# Altium project seed_sentinel.PrjPcb
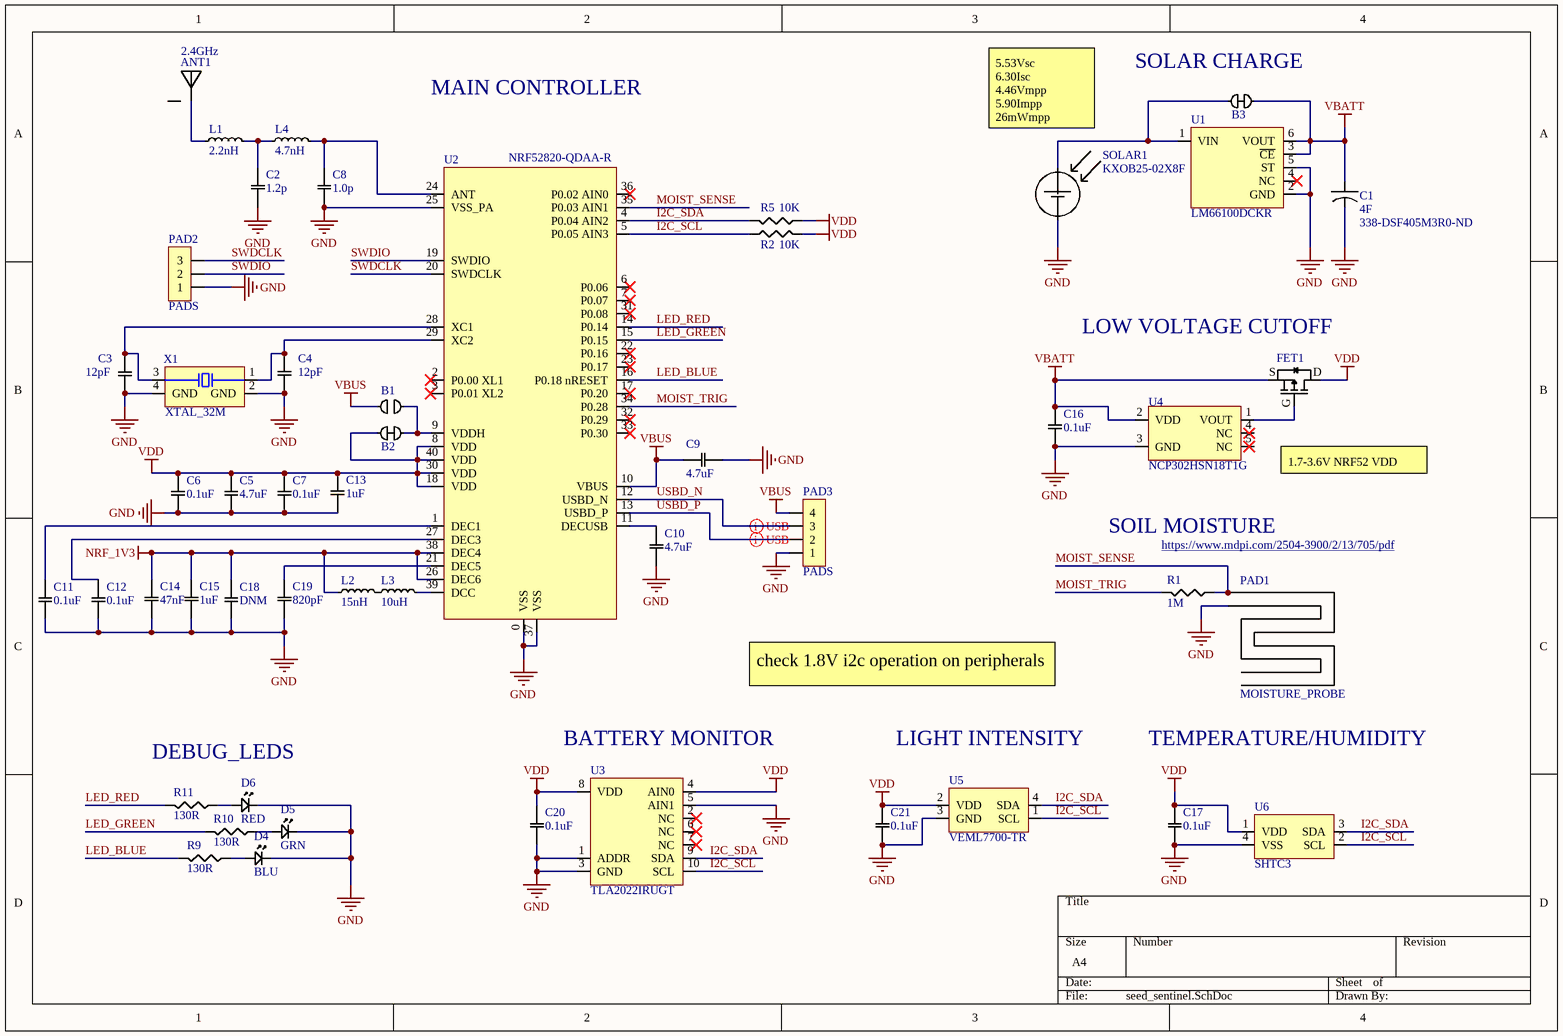
[diagram p0: seed_sentinel.SchDoc]
1 sheet, 50 parts. Net scope: global (net labels, ports and power ports of the same name join across sheets).
Board file: seed_sentinel.PcbDoc

## Sheet seed_sentinel.SchDoc
size A4

### Parts
ANT1  2.4GHz  [ANT_RFANT5220110A2T]
B1  SOLDER_BRIDGE_NO  [SOLDER_BRIDGE_NO]  (value not drawn)
B2  SOLDER_BRIDGE_C  [SOLDER_BRIDGE_NC]  (value not drawn)  (net tie, no BOM)
B3  SOLDER_BRIDGE_C  [SOLDER_BRIDGE_NC]  (value not drawn)  (net tie, no BOM)
C1  4F  Supplier Part Number 1: 338-DSF405M3R0-ND  [CAP_8mm]
C2  1.2p  [CHIP_0402]
C3  12pF  [CHIP_0402]
C4  12pF  [CHIP_0402]
C5  4.7uF  [CHIP_0402]
C6  0.1uF  [CHIP_0402]
C7  0.1uF  [CHIP_0402]
C8  1.0p  [CHIP_0402]
C9  4.7uF  [CHIP_0402]
C10  4.7uF  [CHIP_0402]
C11  0.1uF  [CHIP_0402]
C12  0.1uF  [CHIP_0402]
C13  1uF  [CHIP_0402]
C14  47nF  [CHIP_0402]
C15  1uF  [CHIP_0402]
C16  0.1uF  [CHIP_0402]
C17  0.1uF  [CHIP_0402]
C18  DNM  [CHIP_0402]
C19  820pF  [CHIP_0402]
C20  0.1uF  [CHIP_0402]
C21  0.1uF  [CHIP_0402]
D4  BLU  [LED_0402]
D5  GRN  [LED_0402]
D6  RED  [LED_0402]
FET1  RV2C014BCT2CL  [DFN1006-3]  (value not drawn)
L1  2.2nH  [CHIP_0402]
L2  15nH  [CHIP_0402]
L3  10uH  [CHIP_0603]
L4  4.7nH  [CHIP_0402]
PAD1  MOISTURE_PROBE  [MOIST_CAP]
PAD2  PADS  [CON_PADS_3]
PAD3  PADS  [CON_PADS_4]
R1  1M  [CHIP_0402]
R2  10K  [CHIP_0402]
R5  10K  [CHIP_0402]
R9  130R  [CHIP_0402]
R10  130R  [CHIP_0402]
R11  130R  [CHIP_0402]
SOLAR1  KXOB25-02X8F  [SOLAR]
U1  LM66100DCKR  [SC70-6]
U2  NRF52820-QDAA-R  [QFN40 5x5]
U3  TLA2022IRUGT  [RQFP_10]
U4  NCP302HSN18T1G  [TSOP-5]
U5  VEML7700-TR  [VEML7700]
U6  SHTC3  [SHTC3]
X1  XTAL_32M  [ECS-320]

### Nets
GND: C1.- C2.1 C3.2 C4.1 C5.2 C6.2 C7.2 C8.1 C9.2 C10.2 C11.2 C12.2 C13.1 C14.1 C15.1 C16.2 C17.2 C18.2 C19.1 C20.2 C21.2 D4.C D5.C D6.C PAD1.2 PAD2.1 PAD3.1 SOLAR1.- U1.2(GND) U1.5(ST) U2.0(VSS) U2.25(VSS_PA) U2.37(VSS) U3.1(ADDR) U3.3(GND) U3.5(AIN1) U4.3(GND) U5.3(GND) U6.4(VSS) X1.2(GND) X1.4(GND)
NRF_1V3: C14.2 C15.2 C18.1 L2.1 U2.26(DEC6) U2.38(DEC4)
VBATT: B3.2 C1.+ C16.1 FET1.S U1.3(~{CE}) U1.6(VOUT) U4.2(VDD)
VBUS: B1.2 C9.1 PAD3.4 U2.10(VBUS)
VDD: B2.1 C5.1 C6.1 C7.1 C13.2 C17.1 C20.1 C21.1 FET1.D R2.2 R5.1 U2.8(VDD) U2.18(VDD) U2.30(VDD) U2.40(VDD) U3.4(AIN0) U3.8(VDD) U5.2(VDD) U6.1(VDD)
I2C_SCL: R2.1 U2.5(P0.05_AIN3) U3.10(SCL) U5.1(SCL) U6.2(SCL)
I2C_SDA: R5.2 U2.4(P0.04_AIN2) U3.9(SDA) U5.4(SDA) U6.3(SDA)
LED_BLUE: R9.2 U2.16(P0.18_nRESET)
LED_GREEN: R10.2 U2.15(P0.15)
LED_RED: R11.2 U2.14(P0.14)
MOIST_SENSE: PAD1.1 R1.1 U2.35(P0.03_AIN1)
MOIST_TRIG: R1.2 U2.34(P0.28)
SWDCLK: PAD2.3 U2.20(SWDCLK)
SWDIO: PAD2.2 U2.19(SWDIO)
USBD_N: PAD3.3 U2.12(USBD_N)
USBD_P: PAD3.2 U2.13(USBD_P)
NetANT1_IN: ANT1.IN L1.1
NetB1_1: B1.1 B2.2 U2.9(VDDH)
NetB3_1: B3.1 SOLAR1.+ U1.1(VIN)
NetC2_2: C2.2 L1.2 L4.1
NetC3_1: C3.1 U2.28(XC1) X1.3
NetC4_2: C4.2 U2.29(XC2) X1.1
NetC8_2: C8.2 L4.2 U2.24(ANT)
NetC10_1: C10.1 U2.11(DECUSB)
NetC11_1: C11.1 U2.1(DEC1)
NetC12_1: C12.1 U2.27(DEC3)
NetC19_2: C19.2 U2.21(DEC5)
NetD4_A: D4.A R9.1
NetD5_A: D5.A R10.1
NetD6_A: D6.A R11.1
NetFET1_G: FET1.G U4.1(VOUT)
NetL2_2: L2.2 L3.1
NetL3_2: L3.2 U2.39(DCC)

Not connected (* = marked no-connect by the designer): ANT1 NC; U1 4(NC)*; U2 2(P0.00_XL1)* 3(P0.01_XL2)* 6(P0.06)* 7(P0.07)* 17(P0.20)* 22(P0.16)* 23(P0.17)* 31(P0.08)* 32(P0.29)* 33(P0.30)* 36(P0.02_AIN0)*; U3 2(NC)* 6(NC)* 7(NC)*; U4 4(NC) 5(NC)

### Layout directives
differential pair: USBD_N, USBD_P

### Notes on the sheet
- MAIN CONTROLLER
- (near B3) SOLAR CHARGE
- (near SOLAR1) 5.53Vsc
  6.30Isc
  4.46Vmpp
  5.90Impp
  26mWmpp
- (near FET1) LOW VOLTAGE CUTOFF
- 1.7-3.6V NRF52 VDD
- SOIL MOISTURE
- https://www.mdpi.com/2504-3900/2/13/705/pdf
- check 1.8V i2c operation on peripherals
- DEBUG_LEDS
- BATTERY MONITOR
- LIGHT INTENSITY
- TEMPERATURE/HUMIDITY

### Library data of the parts
ANT1 = ANT_2G4_CHIP_RFANT5220110A2T: 2.4GHz chip antenna; Supplier 1: Digi-Key; Supplier Part Number 1: 1292-1001-1-ND
B2 B3 = SOLDER_BRIDGE_NC
C1 = CAP_4_THRU: 4F 3V supercap; Supplier 1: Digi-Key
C2 = CAP_1.2p_0402: 1.2pF RF capacitor; Supplier 1: Digi-Key; Supplier Part Number 1: 478-10145-1-ND
C3 C4 = CAP_12p_0402: 12pF NP0 0603 Capacitor; Supplier 1: Digi-Key; Supplier Part Number 1: 399-19370-1-ND
C5 C9 C10 = CAP_4.7u_0402: 4.7uF 0603 6.3V; Supplier 1: Digi-Key; Supplier Part Number 1: 587-3711-1-ND
C6 C7 C11 C12 C16 C17 C20 C21 = CAP_100p_0402: 0.1uF X7R 0805 Capacitor; Supplier 1: Digi-Key; Supplier Part Number 1: 1276-1004-1-ND
C8 = CAP_1.0p_0402: 1.0pF RF capacitor; Supplier 1: Digi-Key; Supplier Part Number 1: 732-13231-1-ND
C13 C15 = CAP_1u_0402: Supplier 1: Digi-Key; Supplier Part Number 1: 490-13339-1-ND
C14 = CAP_47n_0402: 47nF 0603 6.3V; Supplier 1: Digi-Key; Supplier Part Number 1: 1292-1213-1-ND
C18 = CAP_DNM_0402
C19 = CAP_820p_0402: 820pF X7R 0805 Capacitor; Supplier 1: Digi-Key; Supplier Part Number 1: 311-3776-1-ND
D4 = LED_BLU_0402: Supplier 1: Digi-Key; Supplier Part Number 1: 350-4448-1-ND
D5 = LED_GRN_0402: Supplier 1: Digi-Key; Supplier Part Number 1: 754-1811-1-ND
D6 = LED_RED_0402: Supplier 1: Digi-Key; Supplier Part Number 1: 1080-EAST1005RA0CT-ND
FET1 = FET_20V_200mA: Supplier 1: Digi-Key; Supplier Part Number 1: RV2C014BCT2CLCT-ND
L1 = IND_2.2n_0402: 2.2nH high frequency; Supplier 1: Digi-Key; Supplier Part Number 1: 445-9409-1-ND
L2 = IND_15n_0402: 15nH chip inductor; Supplier 1: Digi-Key; Supplier Part Number 1: 2184-BSCH0010050515NJCPCT-ND
L3 = IND_10u_0402: 10uH chip inductor; Supplier 1: Digi-Key; Supplier Part Number 1: 535-11587-1-ND
L4 = IND_4.7n_0402: 4.7nH high frequency; Supplier 1: Digi-Key; Supplier Part Number 1: 445-9417-1-ND
PAD2 = CON_PADS_3
PAD3 = CON_PADS_4
R1 = RES_1M_0402: 1Mohm; Supplier 1: Digi-Key; Supplier Part Number 1: 2037-PFR05S-105-FNHCT-ND
R2 R5 = RES_10K_0402: 10Kohm; Supplier 1: Digi-Key; Supplier Part Number 1: CR0402-FX-1002GLFCT-ND
R9-R11 = RES_130R_0402: 130ohm; Supplier 1: Digi-Key; Supplier Part Number 1: RMCF0402JT130RCT-ND
SOLAR1 = SOLAR_5V5_6m3: 26.3mW 6.3mA 5.53V; Supplier 1: Digi-Key; Supplier Part Number 1: KXOB25-02X8F-ND
U1 = DIO_IDEAL: Ideal diode; Supplier 1: Digi-Key; Supplier Part Number 1: 296-53541-1-ND
U3 = SEN_ADC_TLA2022IRUGT: Supplier 1: Digi-Key; Supplier Part Number 1: 296-48345-1-ND
U4 = LVC_1.8V: 1.8V low voltage cutoff; Supplier 1: Digi-Key; Supplier Part Number 1: 488-NCP302HSN18T1GCT-ND
U5 = SEN_LIGHT_VEML7700: Supplier 1: Digi-Key; Supplier Part Number 1: VEML7700CT-ND
U6 = SEN_TEMP_HUMID_SHTC3: Supplier 1: Digi-Key; Supplier Part Number 1: 1649-1105-1-ND
U2 = NRF52820-QDAA-R: Supplier 1: Digi-Key; Supplier Part Number 1: 1490-NRF52820-QDAA-RCT-ND
X1 = XTAL_32M: Supplier 1: Digi-Key; Supplier Part Number 1: 50-ECS-320-8-47B-CKY-CT-ND